# EasyEDA Pro project ProPrj_智能视觉集成板-V1.1.epro, schematic Schematic2

## Sheets
1 子驱 连接器: Board Name: 单驱加电源板; Create Date: 2025-01-11; Page Name: 子驱 连接器; Project Name: 009-智能视觉集成板-V1.1; Schematic Name: Schematic2; Update Date: 2025-01-12; Company: 嘉立创EDA; Page Size: A4; Version: V1.0
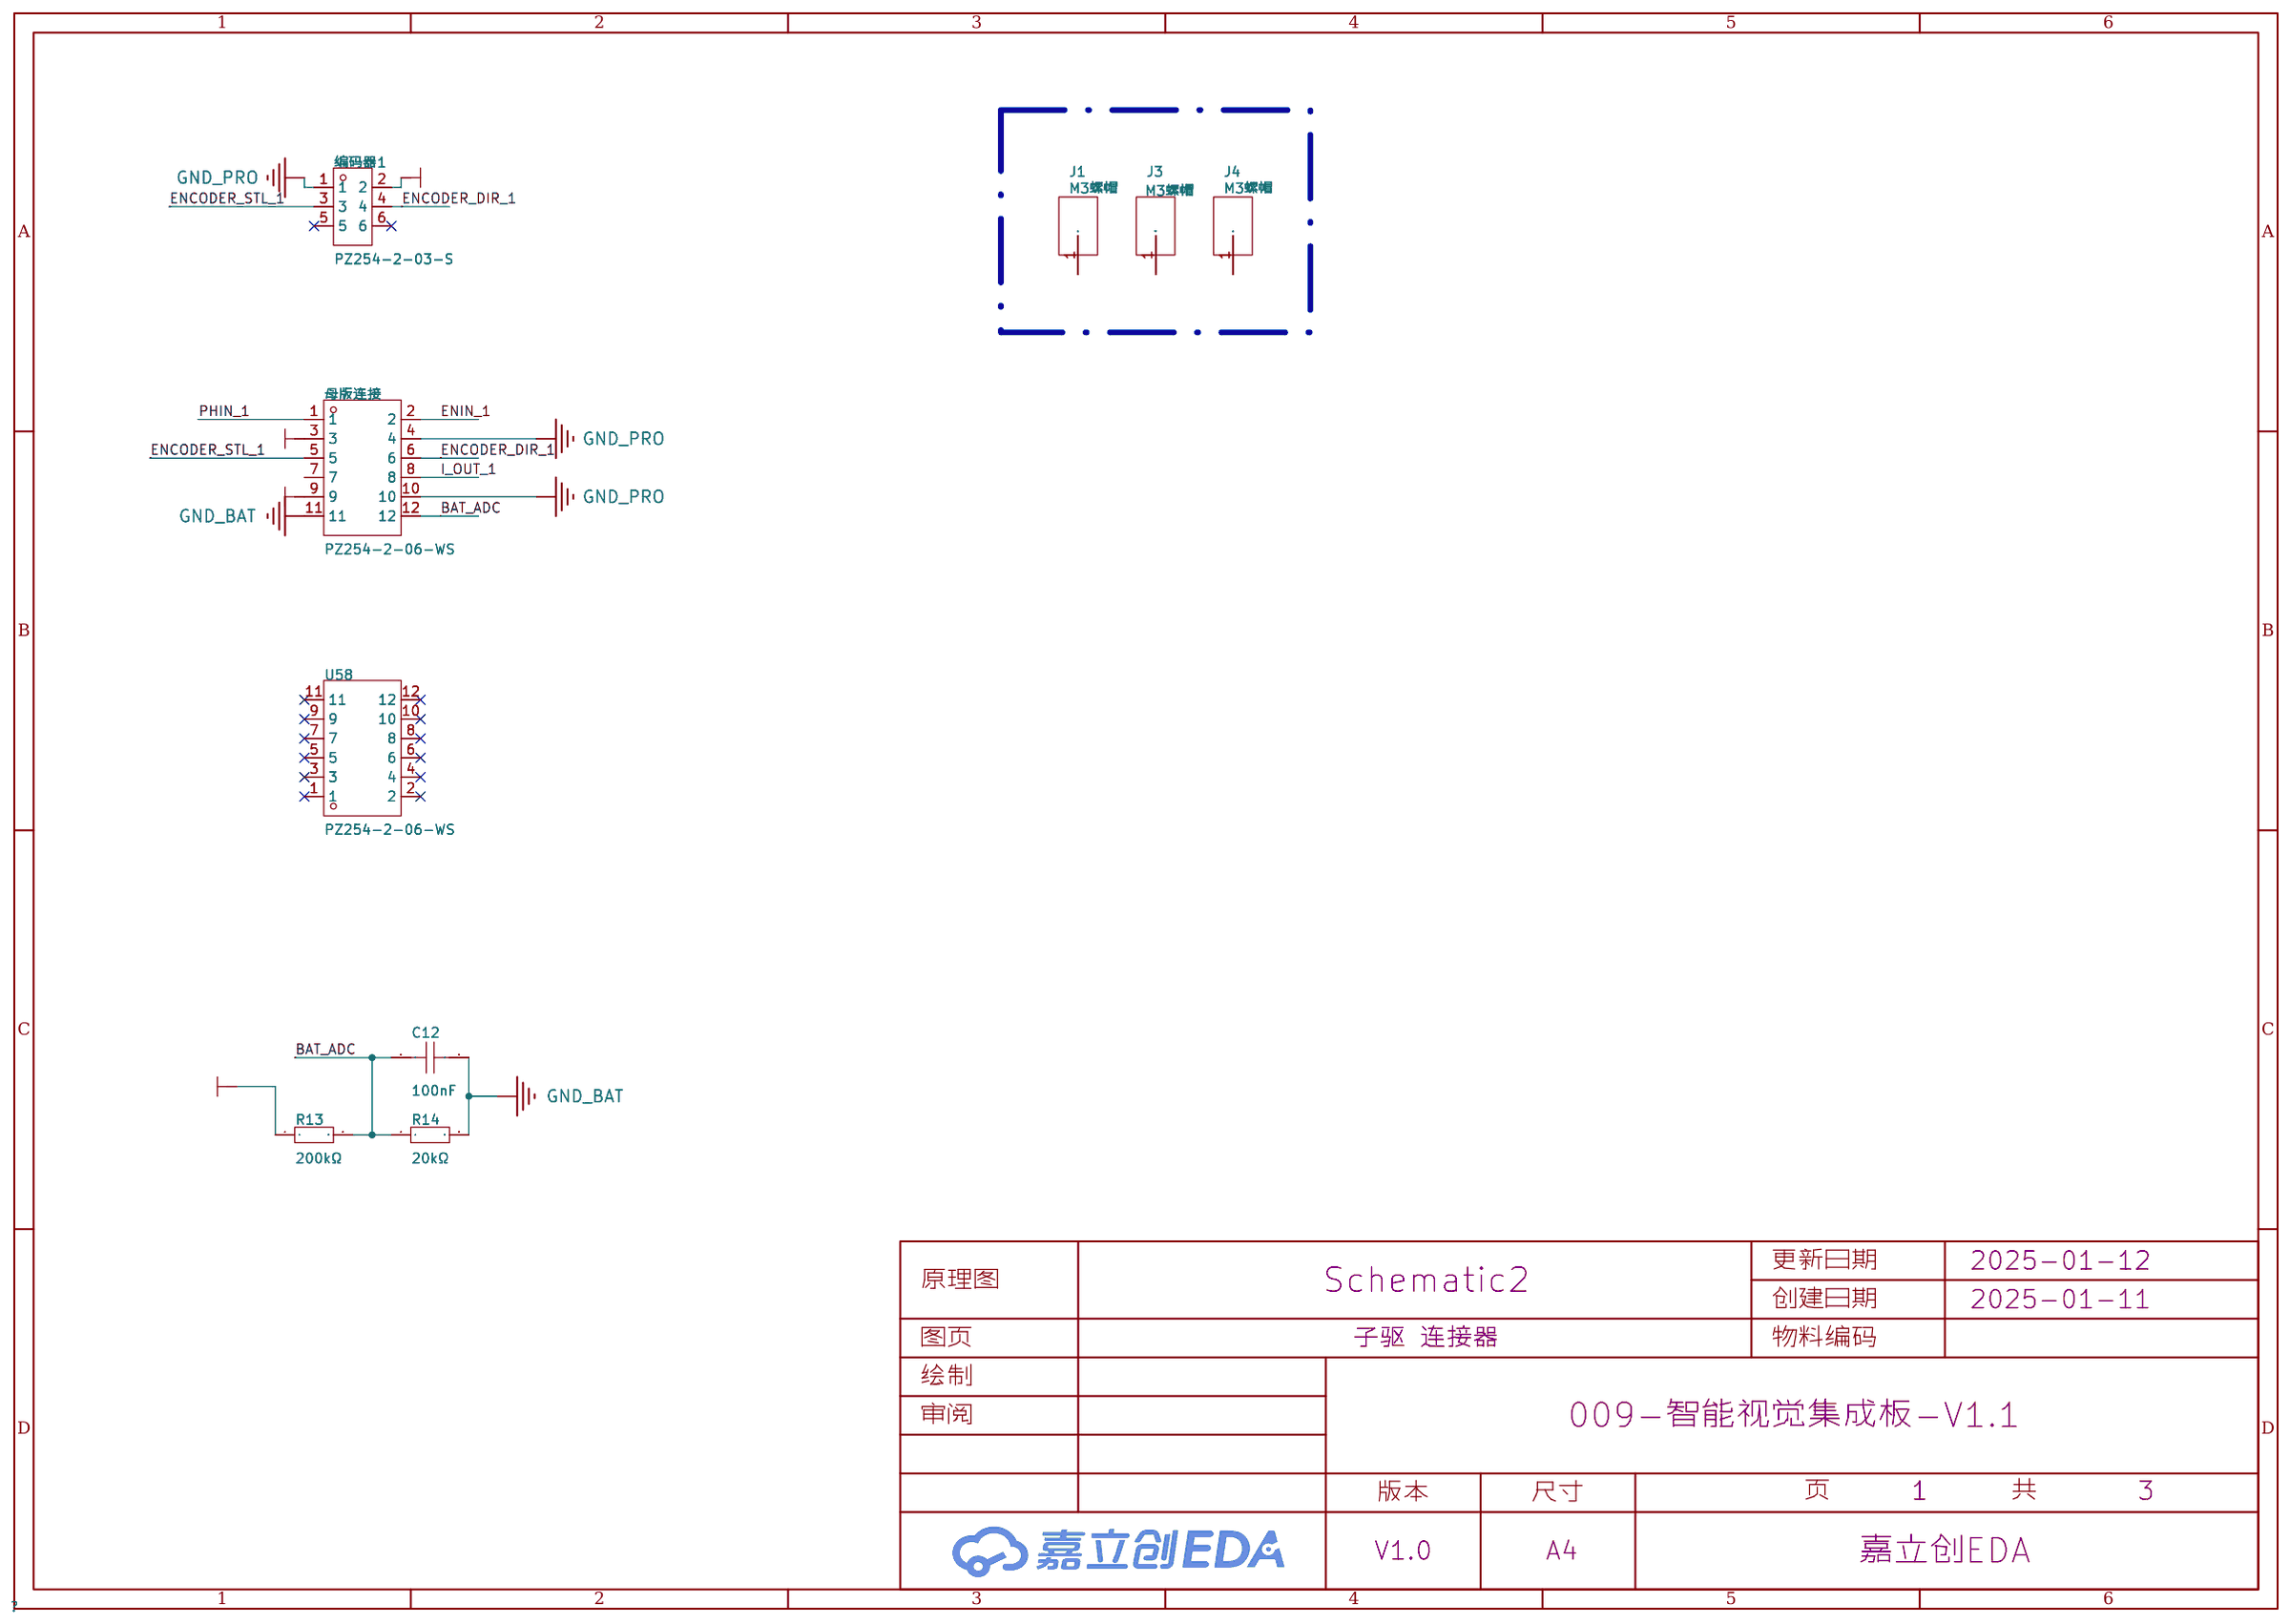
[diagram p3: 子驱 连接器]
2 子驱 单驱: Page Name: 子驱 单驱
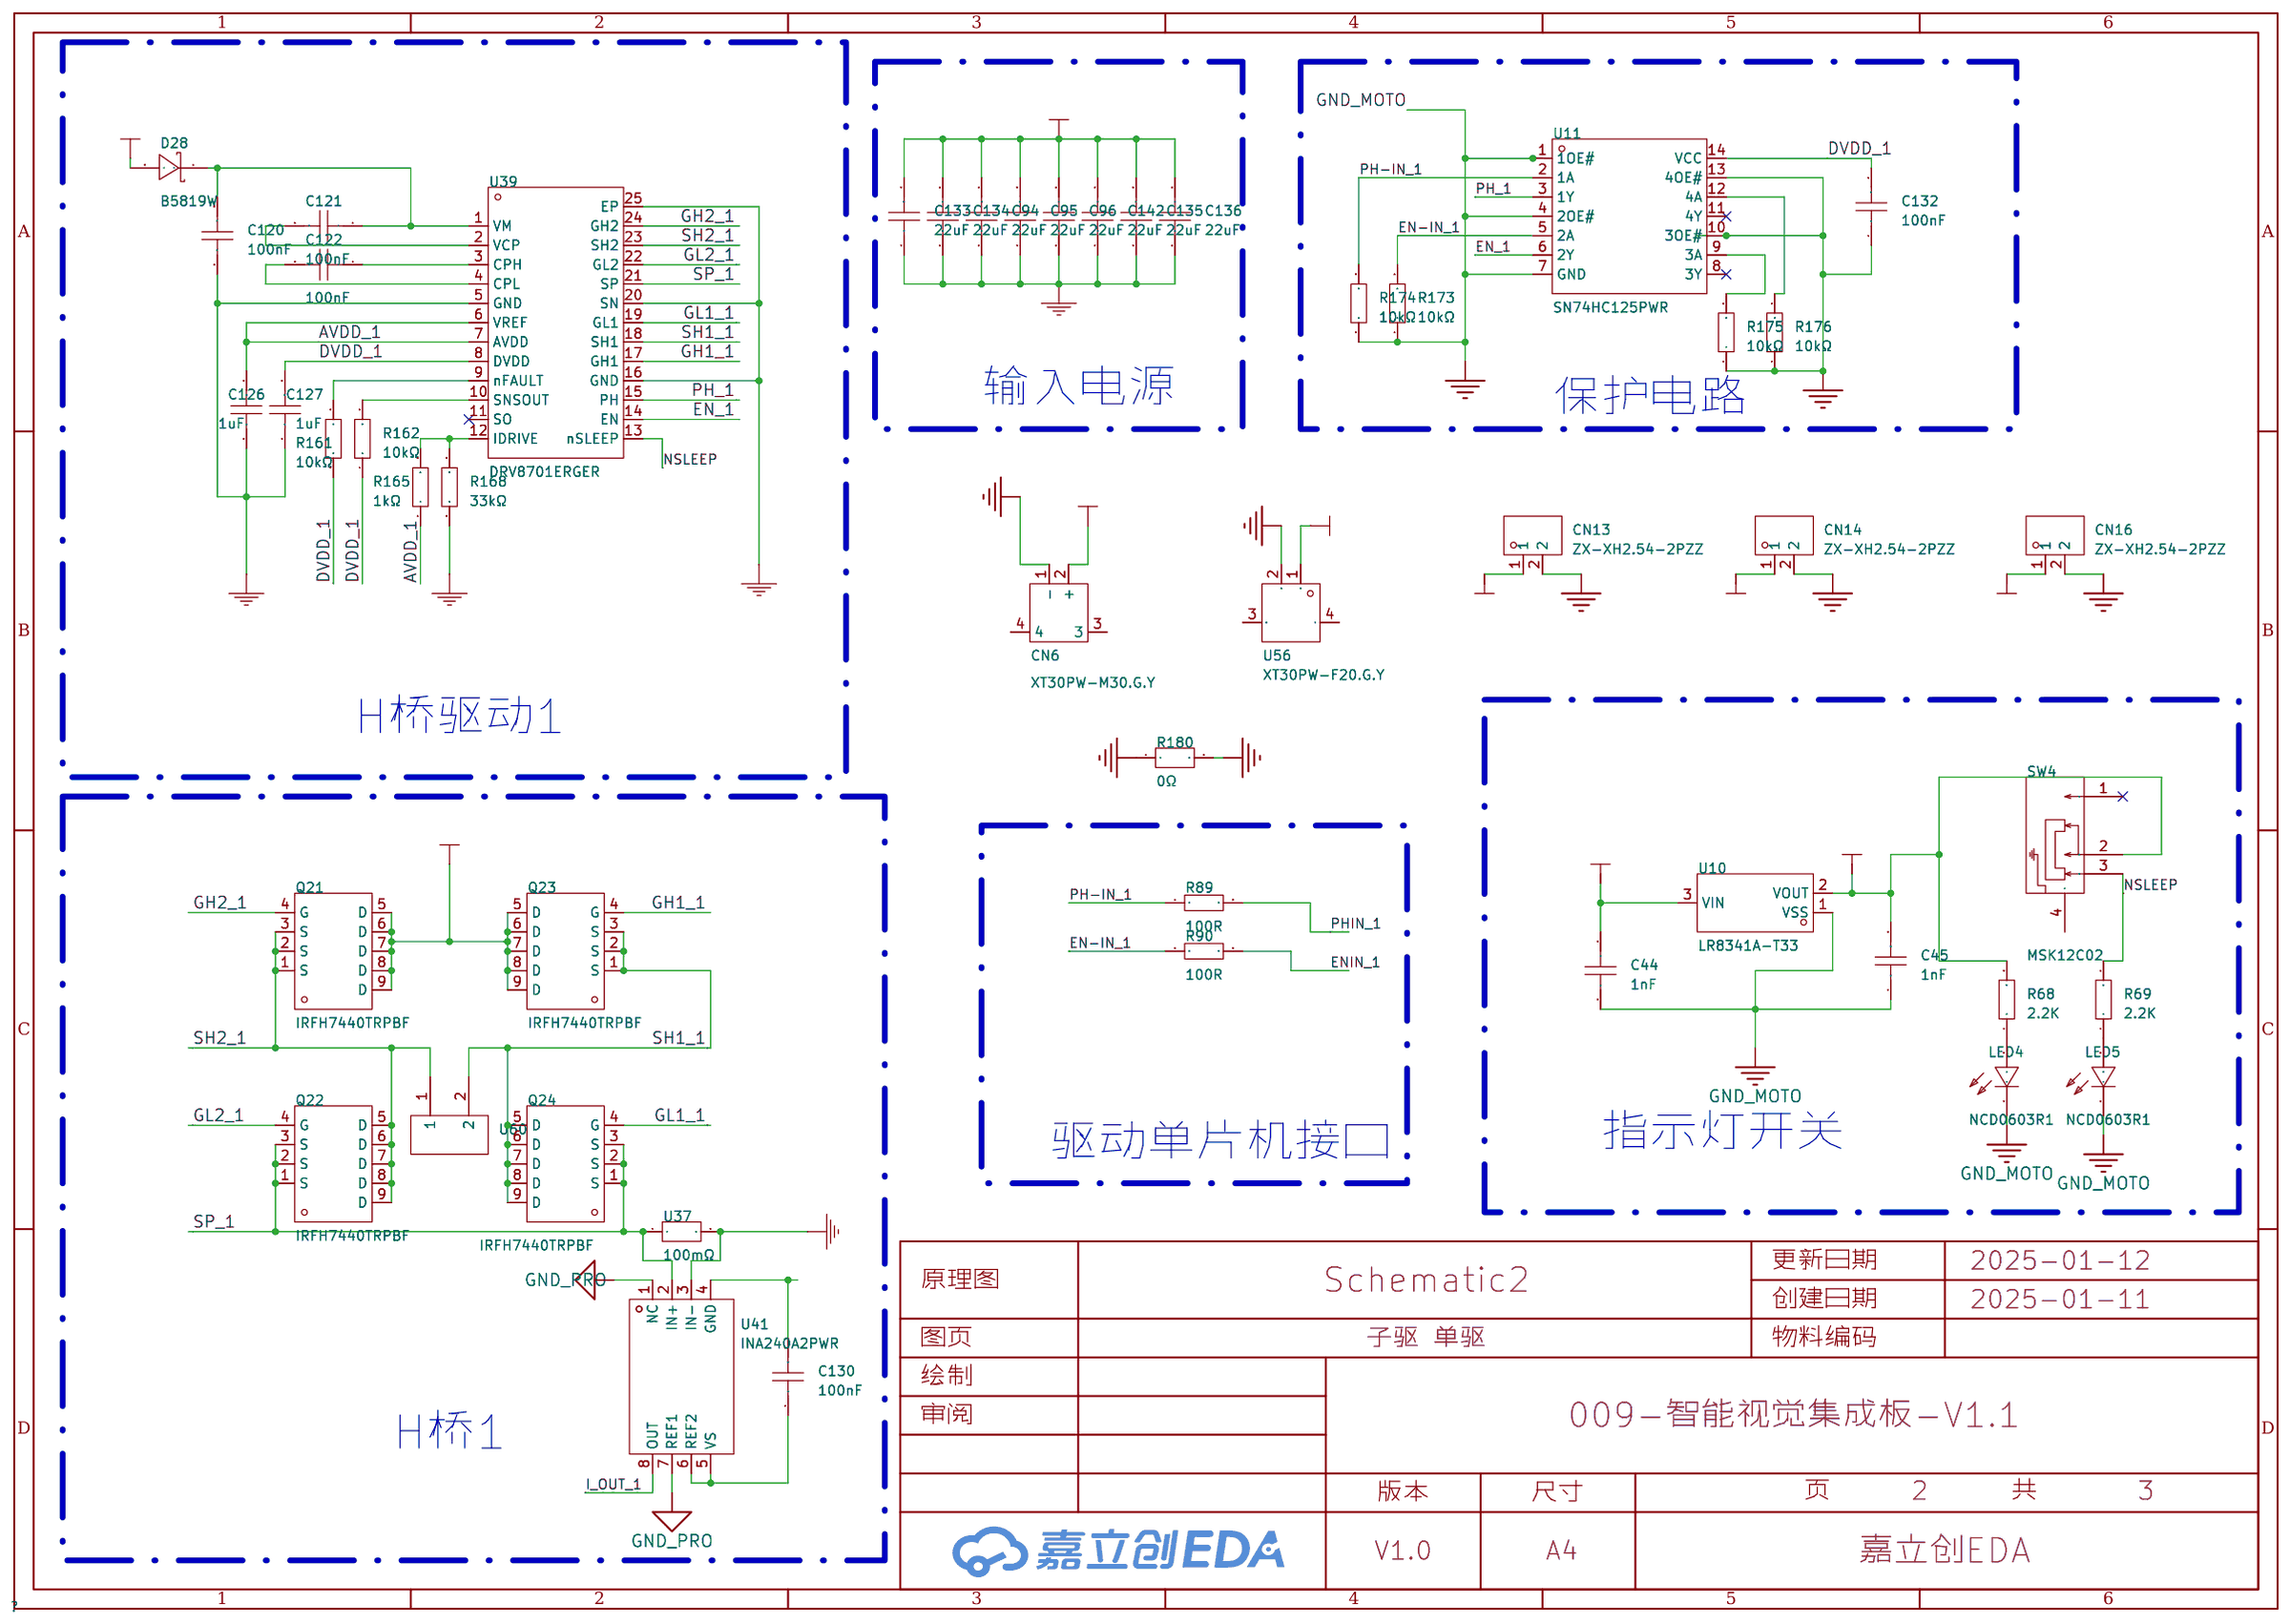
[diagram p4: 子驱 单驱]
3 子驱 舵机: Page Name: 子驱 舵机
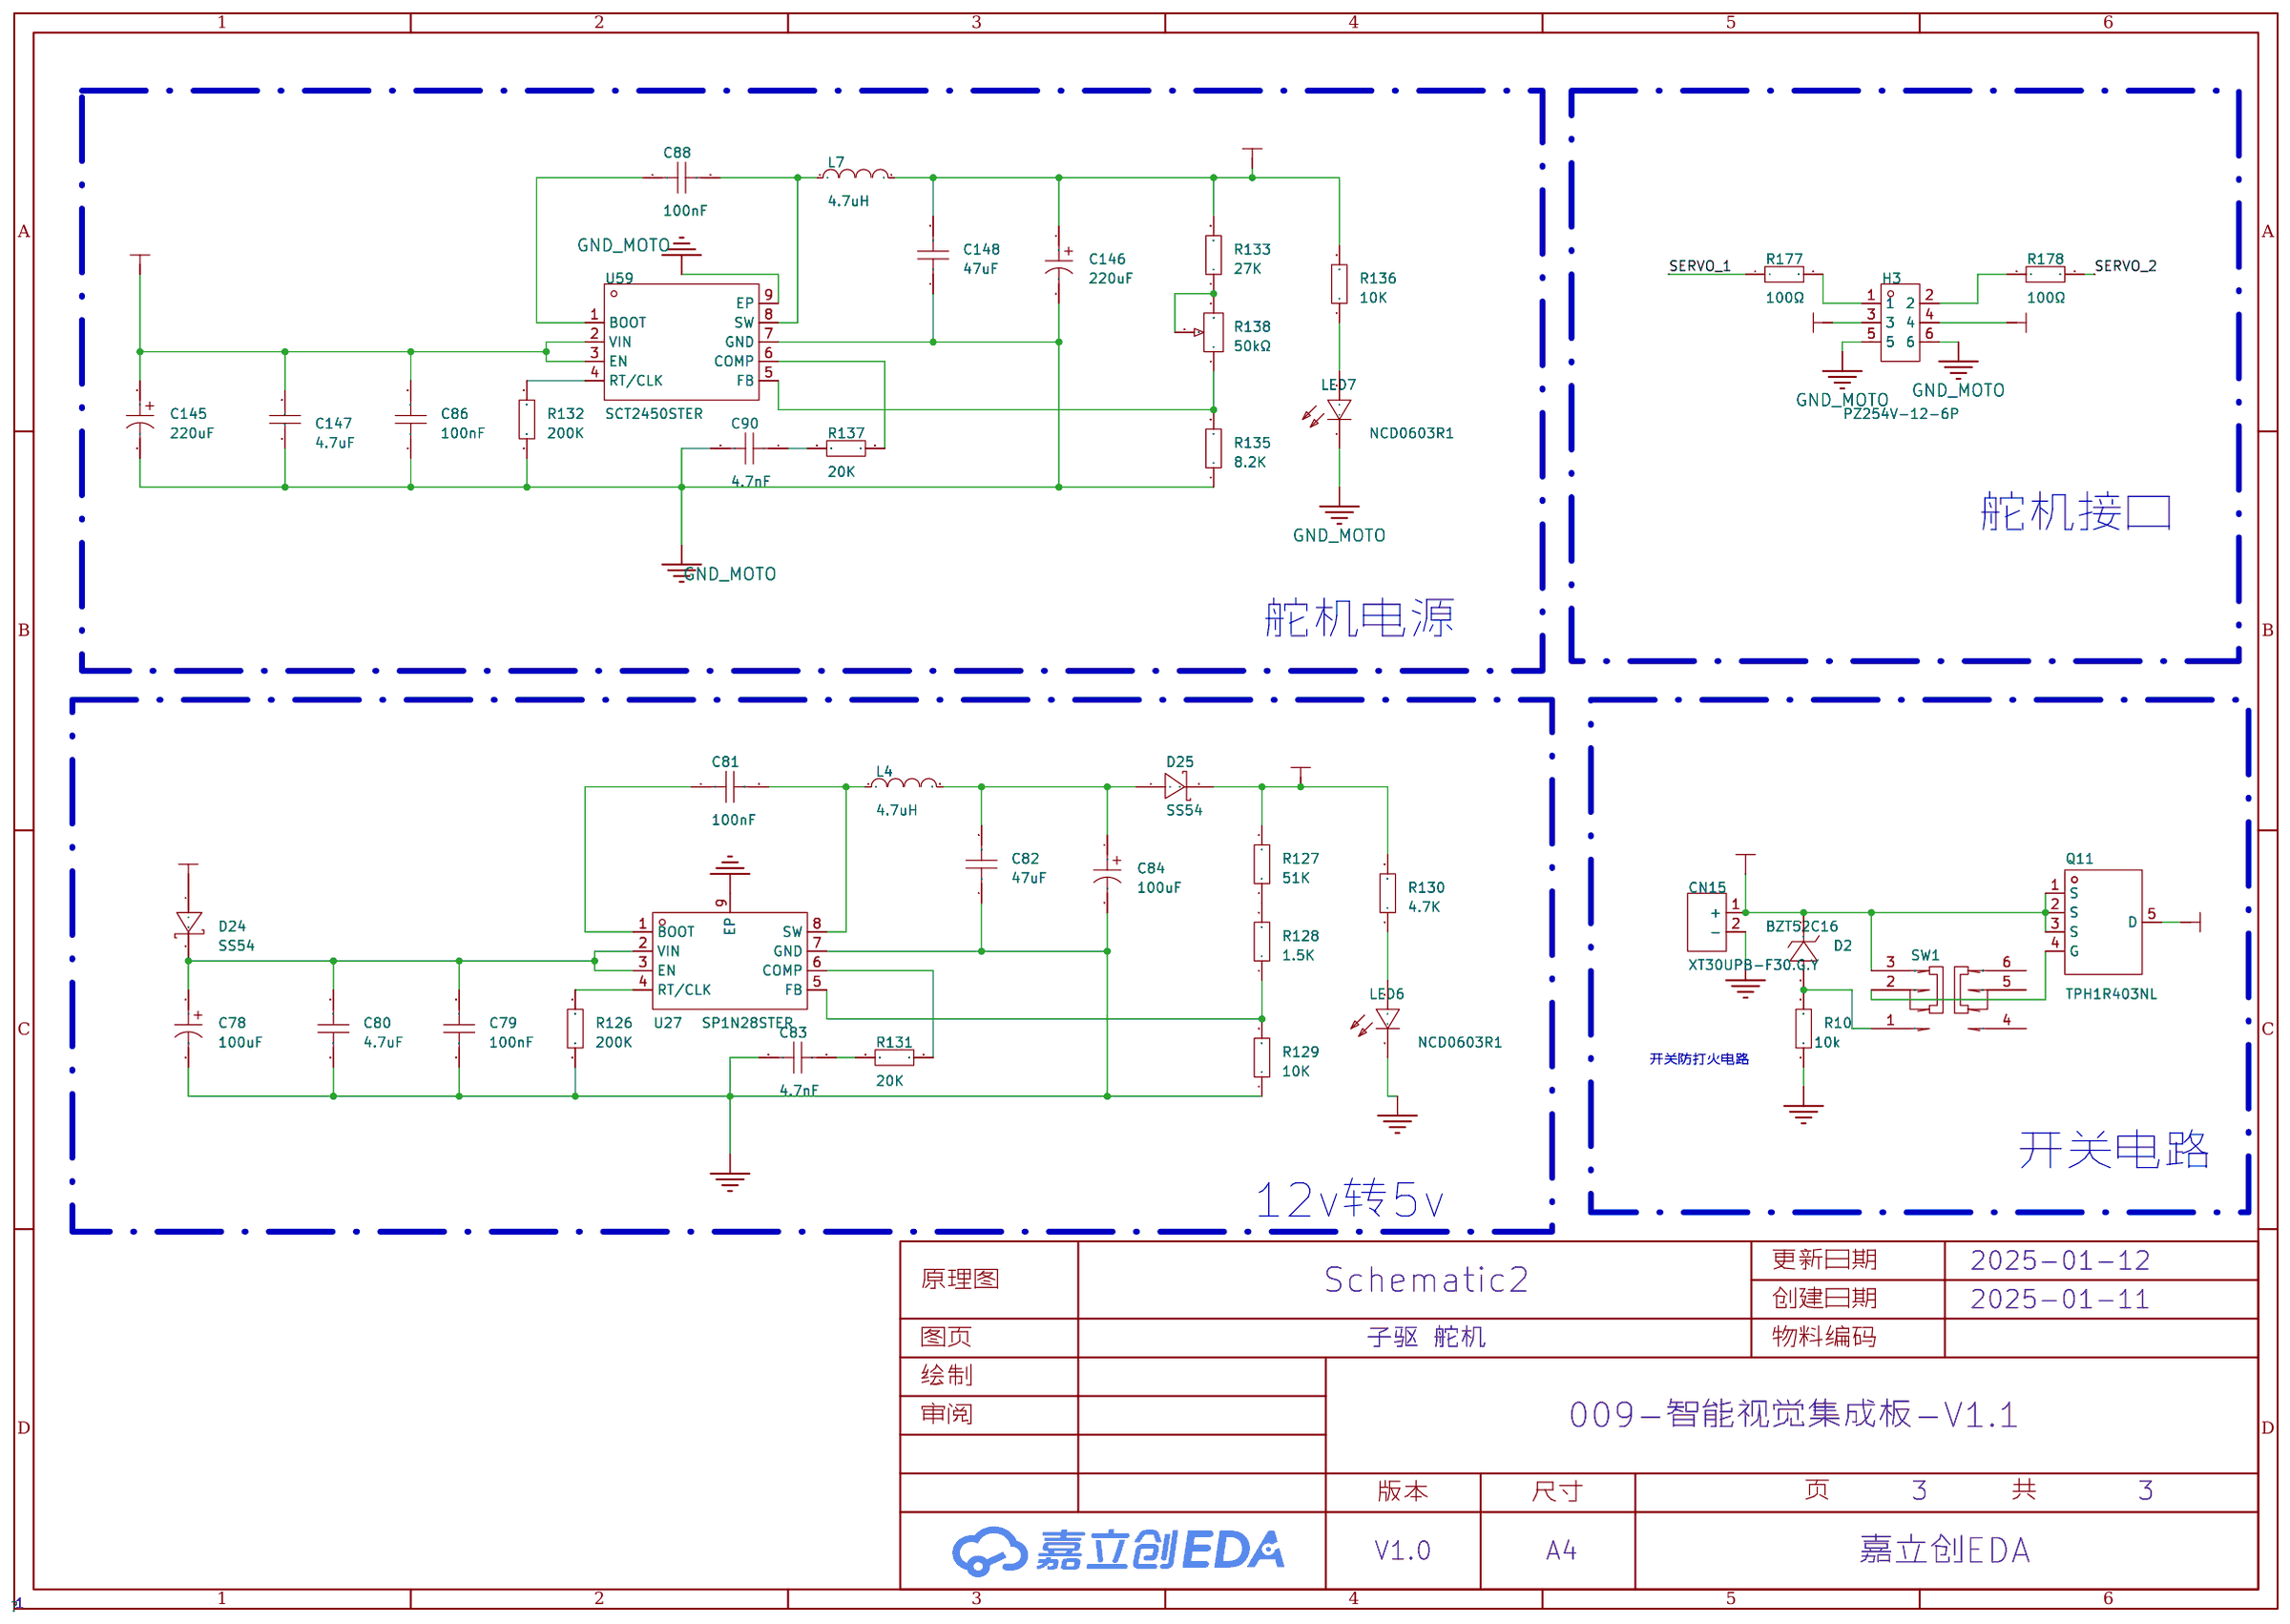
[diagram p5: 子驱 舵机]

## Parts
sheet 子驱 单驱
C44  1nF  [C0603]
C45  1nF  [C0603]
C94  22uF  [c1206]
C95  22uF  [c1206]
C96  22uF  [c1206]
C120  100nF  [C0402]
C121  100nF  [C0402]
C122  100nF  [C0402]
C126  1uF  [C0402]
C127  1uF  [C0402]
C130  100nF  [C0402]
C132  100nF  [C0603]
C133  22uF  [c1206]
C134  22uF  [c1206]
C135  22uF  [c1206]
C136  22uF  [c1206]
C142  22uF  [c1206]
CN6  XT30PW-M30.G.Y  [CONN-TH_XT30PW-M]
CN13  ZX-XH2.54-2PZZ  [CONN-TH_2P-P2.50_HX25003-2A]
CN14  ZX-XH2.54-2PZZ  [CONN-TH_2P-P2.50_HX25003-2A]
CN16  ZX-XH2.54-2PZZ  [CONN-TH_2P-P2.50_HX25003-2A]
D28  B5819W  [SOD-123_L2.8-W1.8-LS3.7-RD]
LED4  NCD0603R1  [LED0603-RD_RED]
LED5  NCD0603R1  [LED0603-RD_RED]
Q21  IRFH7440TRPBF  [DFN-8_L5.8-W4.9-P1.27-LS6.0-BL-1]
Q22  IRFH7440TRPBF  [DFN-8_L5.8-W4.9-P1.27-LS6.0-BL-1]
Q23  IRFH7440TRPBF  [DFN-8_L5.8-W4.9-P1.27-LS6.0-BL-1]
Q24  IRFH7440TRPBF  [DFN-8_L5.8-W4.9-P1.27-LS6.0-BL-1]
R68  2.2K  [R0603]
R69  2.2K  [R0603]
R89  100R  [R0603]
R90  100R  [R0603]
R161  10kΩ  [R0402]
R162  10kΩ  [R0402]
R165  1kΩ  [R0402]
R168  33kΩ  [R0402]
R173  10kΩ  [R0603]
R174  10kΩ  [R0603]
R175  10kΩ  [R0603]
R176  10kΩ  [R0603]
R180  0Ω  [R1206]
SW4  MSK12C02  [SW-TH_MSK12C02]
U10  LR8341A-T33  [SOT-23-3L_L2.9-W1.6-P1.90-LS2.8-BL]
U11  SN74HC125PWR  [TSSOP-14_L5.0-W4.4-P0.65-LS6.5-BL]
U37  100mΩ  [R1206]
U39  DRV8701ERGER  [VQFN-24_L4.0-W4.0-P0.50-BL-EP2.5]
U41  INA240A2PWR  [TSSOP-8_L4.4-W3.0-P0.65-LS6.4-BL]
U56  XT30PW-F20.G.Y  [CONN-TH_XT30PW-F-1]
U60  -  [2P焊接端子（大电流）]
sheet 子驱 舵机
C78  100uF  [CAP-SMD_BD6.3-L6.6-W6.6-LS7.4-FD]
C79  100nF  [C0603]
C80  4.7uF  [c1206]
C81  100nF  [C0603]
C82  47uF  [c1206]
C83  4.7nF  [C0603]
C84  100uF  [CAP-SMD_BD6.3-L6.6-W6.6-LS7.4-FD]
C86  100nF  [C0603]
C88  100nF  [C0603]
C90  4.7nF  [C0603]
C145  220uF  [CAP-SMD_BD6.3-L6.6-W6.6-LS7.8-FD]
C146  220uF  [CAP-SMD_BD6.3-L6.6-W6.6-LS7.8-FD]
C147  4.7uF  [c1206]
C148  47uF  [c1206]
CN15  XT30UPB-F30.G.Y  [CONN-TH_XT30UPB-F]
D2  BZT52C16  [SOD-123_L2.7-W1.7-LS3.8-RD]
D24  SS54  [SMA_L4.4-W2.8-LS5.4-R-RD]
D25  SS54  [SMA_L4.4-W2.8-LS5.4-R-RD]
H3  PZ254V-12-6P  [HDR-TH_6P-P2.54-V-M-R2-C3-S2.54]
L4  4.7uH  [IND-SMD_L7.0-W6.6]
L7  4.7uH  [IND-SMD_L7.0-W6.6]
LED6  NCD0603R1  [LED0603-RD_RED]
LED7  NCD0603R1  [LED0603-RD_RED]
Q11  TPH1R403NL  [POWERVDFN-8_L6.2-W5.2-P1.27-LS6.0-BL]
R10  10K  [R0603]
R126  200K  [R0603]
R127  51K  [R0603]
R128  1.5K  [R0603]
R129  10K  [R0603]
R130  4.7K  [R0603]
R131  20K  [R0603]
R132  200K  [R0603]
R133  27K  [R0603]
R135  8.2K  [R0603]
R136  10K  [R0603]
R137  20K  [R0603]
R138  50kΩ  [RES-ADJ-TH_3P-L5.0-W4.5-P2.35-BR]
R177  100Ω  [R0603]
R178  100Ω  [R0603]
SW1  SS-3235S-L3  [SW-SMD_SS-3235S-L3.00]
U27  SP1N28STER  [ESOP-8_L4.9-W3.9-P1.27-LS6.0-BL-EP3.1]
U59  SCT2450STER  [ESOP-8_L4.9-W3.9-P1.27-LS6.0-BL-EP]
sheet 子驱 连接器
C12  100nF  [C0603]
J1  M3螺帽  [M3螺帽]
J3  M3螺帽  [M3螺帽]
J4  M3螺帽  [M3螺帽]
R13  200kΩ  [R0603]
R14  20kΩ  [R0603]
U58  PZ254-2-06-WS  [HDR-SMD_12P-P2.54_HCTL_PZ254-2-06-WS]
母版连接  PZ254-2-06-WS  [HDR-SMD_12P-P2.54_HCTL_PZ254-2-06-WS]
编码器1  PZ254-2-03-S  [HDR-SMD_6P-P2.54-V-M-R2-C3-LS7.5-2]

## Library data of the parts
C44 C45 C79-C83 C86 C88 C90 = CAP_0603: Supplier Footprint: 0603
C94-C96 C133-C136 C142 = CGA1206X5R226M350NT: 容值:22uF;精度:±20%;额定电压:35V;材质(温度系数):X5R;; LCSC Part Name: 22uF ±20% 35V; Supplier Part: C6119969; Manufacturer: HRE(芯声); Supplier Footprint: 1206; JLCPCB Part Class: 扩展库; Supplier: LCSC; Tolerance: ±20%; Voltage Rated: 35V; Temperature Coefficient: X5R
C120-C122 C130 = CL05B104KB54PNC: 容值:100nF;精度:±10%;额定电压:50V;材质(温度系数):X7R;; LCSC Part Name: 100nF ±10% 50V; Supplier Part: C307331; Manufacturer: SAMSUNG(三星); Supplier Footprint: 0402; JLCPCB Part Class: 基础库; Datasheet: https://atta.szlcsc.com/upload/public/pdf/source/20160218/1457707763339.pdf; Supplier: LCSC; Tolerance: ±10%; Voltage Rated: 50V; Temperature Coefficient: X7R
C126 C127 = GRM155R61H105KE05D: 容值:1uF;精度:±10%;额定电压:50V;材质(温度系数):X5R;; LCSC Part Name: 1uF ±10% 50V; Supplier Part: C1518208; Manufacturer: muRata(村田); Supplier Footprint: 0402; JLCPCB Part Class: 扩展库; Datasheet: https://atta.szlcsc.com/upload/public/pdf/source/20210607/3F03D47137F6EC7729AB4067EB2A6EB3.pdf; Supplier: LCSC; Tolerance: ±10%; Voltage Rated: 50V; Temperature Coefficient: X5R
C12 C132 = CGA0603X7R104K500JT: 容值:100nF;精度:±10%;额定电压:50V;材质(温度系数):X7R;; LCSC Part Name: 100nF ±10% 50V; Supplier Part: C6119867; Manufacturer: HRE(芯声); Supplier Footprint: 0603; JLCPCB Part Class: 扩展库; Supplier: LCSC; Tolerance: ±10%; Voltage Rated: 50V; Temperature Coefficient: X7R
CN6 = XT30PW-M30.G.Y: 类别:-;类型1:-;; LCSC Part Name: AMASS(艾迈斯)航模插头 卧式弯脚 XT30PW-M公头; Supplier Part: C431092; Manufacturer: AMASS(艾迈斯); JLCPCB Part Class: 扩展库; Datasheet: https://atta.szlcsc.com/upload/public/pdf/source/20220222/6A9F22F7850E25B33E1BE430ADF8560B.pdf; Supplier: LCSC; Type: 航模插头; RatedVoltage: DC 500V; InterfaceType: 公头; RatedCurrent: 15A; RecommendedWireGauge: 16/18/20AWG; contact resistance: 1.2mΩ; specifications: 2pin
CN13 CN14 CN16 = ZX-XH2.54-2PZZ: 插针结构:1x2P;间距:-;安装方式:直插;参考系列:XH;总PIN数:2P;排数:1;每排PIN数:2;行距:-;额定电流:3A;触头材质:黄铜;触头镀层:锡;工作温度范围:-25℃~+85℃;; LCSC Part Name: 1x2P 直插 系列:XH 黄色耐高温型号：ZX-XH2.54-2PZZ-Y 红色耐高温型号：ZX-XH2.54-2PZZ-R 配套胶壳型号：ZX-XH2.54-2PJK 配套端子型号：ZX-XH2.54-DZ 配套杜邦线型号：ZX-XH2.54-2PBXC; Supplier Part: C7429632; Manufacturer: Megastar(兆星); JLCPCB Part Class: 扩展库; Datasheet: https://atta.szlcsc.com/upload/public/pdf/source/20230619/19BA6947230AA44A04D3EDD65E618FD0.pdf; Supplier: LCSC; Pins Structure: 1x2P; Mounting Style: 直插; Reference Series: XH; Number of Pins: 2P; Number of Rows: 1; Number of PINs Per Row: 2; Current Rating (Max): 3A; Contact Material: 黄铜; Contact Plating: 锡; Operating Temperature Range: -25℃~+85℃
D28 = B5819W_C64885: 二极管配置:独立式;正向压降(Vf):900mV@3A;直流反向耐压(Vr):40V;整流电流:1A;; LCSC Part Name: 电压:40V 电流:1A; Supplier Part: C64885; Manufacturer: MDD(辰达半导体); Supplier Footprint: SOD-123; JLCPCB Part Class: 扩展库; Datasheet: https://atta.szlcsc.com/upload/public/pdf/source/20230823/08094EB15E96CCD3558B35DDD25E45C2.pdf; Supplier: LCSC; Diode Configuration: 独立式; Forward Voltage (Vf@If): 900mV@3A; Reverse Voltage (Vr): 40V; Rectified Current: 1A; Reverse Leakage Current (Ir): 1mA@40V
LED4-LED7 = NCD0603R1_C84263: 灯头类型:-;发光颜色:红色;正向电压(VF):1.6V~2.6V;功率:65mW;正向电流:20mA;主波长:615nm~630nm;二极管配置:独立二极管;透镜颜色:无色透明透镜;色温:-;发光强度:80mcd~220mcd;发光角度:130°;载带方式:-;工作温度:-30℃~+85℃;; Supplier Part: C84263; Manufacturer: 国星光电; Supplier Footprint: 0603; JLCPCB Part Class: 扩展库; Datasheet: https://atta.szlcsc.com/upload/public/pdf/source/20200820/C84263_DABC6A75E58F576973B407FDBA283D60.pdf; Supplier: LCSC; Emitted Color: 红色; Forward Voltage (VF): 1.6V~2.6V; Power Dissipation: 65mW; Forward Current: 20mA; Dominant Wavelength: 615nm~630nm; Diode Configuration: 独立二极管; Lens Color: 无色透明透镜; Luminous Intensity: 80mcd~220mcd; Viewing Angle: 130°; Operating Temperature: -30℃~+85℃
Q21-Q24 = IRFH7440TRPBF: 类型:N沟道;漏源电压(Vdss):40V;连续漏极电流(Id):85A;功率(Pd):104W;导通电阻(RDS(on)@Vgs,Id):2.4mΩ@10V,50A;阈值电压(Vgs(th)@Id):3.9V@100uA;; LCSC Part Name: N沟道 耐压:40V 电流:85A; Supplier Part: C67862; Manufacturer: Infineon(英飞凌); Supplier Footprint: PQFN(5x6); JLCPCB Part Class: 扩展库; Datasheet: https://atta.szlcsc.com/upload/public/pdf/source/20190419/C386359_273C98C00830BF5419F9D4766EDDF693.pdf; Supplier: LCSC; Type: N沟道; Drain Source Voltage (Vdss): 40V; Continuous Drain Current (Id): 85A; Power Dissipation (Pd): 104W; Drain Source On Resistance (RDS(on)@Vgs,Id): 2.4mΩ@10V,50A; Gate Threshold Voltage (Vgs(th)@Id): 3.9V@100uA; Total Gate Charge (Qg@Vgs): 138nC@10V; Input Capacitance (Ciss@Vds): 4.574nF@25V; Operating Temperature: -55℃~+150℃@(Tj)
R10 R68 R69 R89 R90 R126-R133 R135-R137 = Res_0603: Supplier Footprint: 0603
R161 R162 = 0402WGF1002TCE: 电阻类型:厚膜电阻;阻值:10kΩ;精度:±1%;功率:62.5mW;最大工作电压:50V;温度系数:±100ppm/℃;; LCSC Part Name: 10kΩ ±1% 62.5mW 厚膜电阻; Supplier Part: C25744; Manufacturer: UNI-ROYAL(厚声); Supplier Footprint: 0402; JLCPCB Part Class: 基础库; Datasheet: https://atta.szlcsc.com/upload/public/pdf/source/20200306/C422600_1E6D84923E4A46A82E41ADD87F860B5C.pdf; Supplier: LCSC; Type: 厚膜电阻; Tolerance: ±1%; Power(Watts): 62.5mW; Overload Voltage (Max): 50V; Temperature Coefficient: ±100ppm/℃; Operating Temperature Range: -55℃~+155℃
R165 = 0402WGF1001TCE: 电阻类型:厚膜电阻;阻值:1kΩ;精度:±1%;功率:62.5mW;最大工作电压:50V;温度系数:±100ppm/℃;; LCSC Part Name: 1kΩ ±1% 62.5mW 厚膜电阻; Supplier Part: C11702; Manufacturer: UNI-ROYAL(厚声); Supplier Footprint: 0402; JLCPCB Part Class: 基础库; Datasheet: https://atta.szlcsc.com/upload/public/pdf/source/20200306/C422600_1E6D84923E4A46A82E41ADD87F860B5C.pdf; Supplier: LCSC; Type: 厚膜电阻; Tolerance: ±1%; Power(Watts): 62.5mW; Overload Voltage (Max): 50V; Temperature Coefficient: ±100ppm/℃; Operating Temperature Range: -55℃~+155℃
R168 = 0402WGF3302TCE: 电阻类型:厚膜电阻;阻值:33kΩ;精度:±1%;功率:62.5mW;最大工作电压:50V;温度系数:±100ppm/℃;; LCSC Part Name: 33kΩ ±1% 62.5mW 厚膜电阻; Supplier Part: C25779; Manufacturer: UNI-ROYAL(厚声); Supplier Footprint: 0402; JLCPCB Part Class: 基础库; Datasheet: https://atta.szlcsc.com/upload/public/pdf/source/20200306/C422600_1E6D84923E4A46A82E41ADD87F860B5C.pdf; Supplier: LCSC; Type: 厚膜电阻; Tolerance: ±1%; Power(Watts): 62.5mW; Overload Voltage (Max): 50V; Temperature Coefficient: ±100ppm/℃; Operating Temperature Range: -55℃~+155℃
R173-R176 = 0603WAF1002T5E: 电阻类型:厚膜电阻;阻值:10kΩ;精度:±1%;功率:100mW;最大工作电压:75V;温度系数:±100ppm/℃;; LCSC Part Name: 厚膜电阻 10kΩ ±1% 100mW; Supplier Part: C25804; Manufacturer: UNI-ROYAL(厚声); Supplier Footprint: 0603; JLCPCB Part Class: 基础库; Datasheet: https://atta.szlcsc.com/upload/public/pdf/source/20200306/C422600_1E6D84923E4A46A82E41ADD87F860B5C.pdf; Supplier: LCSC; Type: 厚膜电阻; Tolerance: ±1%; Power(Watts): 100mW; Overload Voltage (Max): 75V; Temperature Coefficient: ±100ppm/℃; Operating Temperature Range: -55℃~+155℃
R180 = FRC1206P000 TS: 电阻类型:厚膜电阻;阻值:0Ω;精度:±5%;功率:250mW;最大工作电压:200V;; LCSC Part Name: 0Ω ±5% 250mW 厚膜电阻; Supplier Part: C2907406; Manufacturer: FOJAN(富捷); Supplier Footprint: 1206; JLCPCB Part Class: 扩展库; Datasheet: https://atta.szlcsc.com/upload/public/pdf/source/20211221/925EC7D7225764EE0046F22065062C87.pdf; Supplier: LCSC; Type: 厚膜电阻; Tolerance: ±5%; Power(Watts): 250mW; Overload Voltage (Max): 200V; Operating Temperature Range: -55℃~+155℃
SW4 = MSK12C02: 电路结构:单刀双掷;安装方式:卧贴;开关颜色:-;额定电流(DC):50mA;额定电压(DC):12V;额定电流(AC):-;额定电压(AC):-;机械寿命:1万次;; LCSC Part Name: 两档侧拨贴片 7脚 滑动开关; Supplier Part: C431540; Manufacturer: SHOU HAN(首韩); Supplier Footprint: SMD; JLCPCB Part Class: 扩展库; Datasheet: https://atta.szlcsc.com/upload/public/pdf/source/20190925/C431540_89155AEF0758B9AD1B2D805F83FB12E3.pdf; Supplier: LCSC; Circuit: 单刀双掷; Pin Style: SMD接片; Switch Length: 8mm; Switch Width: 2.8mm; Switch Height: 1.4mm; Mounting Style: 卧贴; Current Rating (DC): 50mA; Voltage Rating (DC): 12V; Mechanical Life: 1万次; Operating Temperature: -20℃~+70℃
U10 = LR8341A-T33: 输出类型:固定;最大输入电压:40V;输出电压:3.3V;最大输出电流:100mA;电源纹波抑制比(PSRR):55dB@(1kHz);输出极性:正极;; LCSC Part Name: 输入40V 输出3.3V 100mA; Supplier Part: C2829465; Manufacturer: LR(朗瑞); Supplier Footprint: SOT-23-3L; JLCPCB Part Class: 扩展库; Datasheet: https://atta.szlcsc.com/upload/public/pdf/source/20210426/C2829465_61F15D7ACE9671B48D4F69A8092B0D8F.pdf; Supplier: LCSC; Output Type: 固定; Maximum Input Voltage: 40V; Output Voltage: 3.3V; MAX Output Current: 100mA; Power Supply Rejection Ratio (PSRR): 55dB@(1kHz); standby current: 2uA; Operating Temperature: -40℃~+85℃; Output Polarity: 正极; Number of Outputs: 1
U11 = SN74HC125PWR: 输入类型:-;电源电压:2V~6V;元件数:4;每个元件位数:1;灌电流(IOL):7.8mA;拉电流(IOH):7.8mA;; Supplier Part: C132994; Manufacturer: TI(德州仪器); Supplier Footprint: TSSOP-14; JLCPCB Part Class: Extended Part; Datasheet: https://www.ti.com/cn/lit/gpn/sn74hc125; Supplier: LCSC; output type: 三态; Supply Voltage: 2V~6V; Number of Elements: 4; Number of Bits per Element: 1; Sink Current: 7.8mA; Source Current: 7.8mA; Logic Family: 74HC; Operating Temperature: -40℃~+85℃
U37 = FRM121WFR010TM: 电阻类型:采样电阻;阻值:10mΩ;精度:±1%;额定压降:-;功率:1W;温度系数:±50ppm/℃;安装方式:-;; LCSC Part Name: 10mΩ ±1% 1W; Supplier Part: C7467248; Manufacturer: FOJAN(富捷); Supplier Footprint: 1206; JLCPCB Part Class: 扩展库; Datasheet: https://atta.szlcsc.com/upload/public/pdf/source/20240709/7FCE84187288C94C67B1004F90EDDF14.pdf; Supplier: LCSC; Type: 采样电阻; Tolerance: ±1%; Power(Watts): 1W; Temperature Coefficient: ±50ppm/℃
U39 = DRV8701ERGER: DRV8701 47V H 桥智能栅极驱动器; LCSC Part Name: 有刷直流电机驱动芯片 45V; Supplier Part: C90964; Manufacturer: TI(德州仪器); Supplier Footprint: VQFN-24-EP(4x4); JLCPCB Part Class: 扩展库; Datasheet: https://www.ti.com/cn/lit/gpn/drv8701; Supplier: LCSC
U41 = INA240A2PWR: 放大器数:单路;; Supplier Part: C129949; Manufacturer: TI(德州仪器); Supplier Footprint: TSSOP-8; JLCPCB Part Class: 扩展库; Datasheet: https://www.ti.com/cn/lit/gpn/ina240; Supplier: LCSC; Number of Channels: 单路; Supply Current: 1.8mA; Operating Temperature: -40℃~+125℃
U56 = XT30PW-F20.G.Y: 类别:-;类型1:-;; LCSC Part Name: AMASS(艾迈斯)电源连接器 母头 XT30PW-F; Supplier Part: C2913282; Manufacturer: AMASS(艾迈斯); JLCPCB Part Class: 扩展库; Datasheet: https://atta.szlcsc.com/upload/public/pdf/source/20231218/06CFCF98887A9A87638B0856A725C8FD.pdf; Supplier: LCSC; Type: 航模插头; InterfaceType: 母头
U60 = 大电流焊接端子
C78 C84 = RVT100UF35V67RV0034: 容值:100uF;精度:±20%;额定电压:35V;纹波电流:87mA@120kHz;等效串联电阻:-;; LCSC Part Name: 100uF ±20% 35V; Supplier Part: C2836442; Manufacturer: KNSCHA(科尼盛); Supplier Footprint: SMD,D6.3xL7.7mm; JLCPCB Part Class: 扩展库; Datasheet: https://atta.szlcsc.com/upload/public/pdf/source/20210528/C2836442_7F6389BF36F63F32D6DF3A507E8E95D6.pdf; Supplier: LCSC; Tolerance: ±20%; Rated Voltage: 35V; Ripple Current: 87mA@120kHz; φD: 6.3mm; L: 7.7mm; Lifetime @ Temp: 2000hrs@105℃; Operating Temperature: -55℃~+105℃
C145 C146 = GVT1E227M0608CNVC: 容值:220uF;精度:±20%;额定电压:25V;纹波电流:120mA@120Hz;; LCSC Part Name: 220uF ±20% 25V; Supplier Part: C2983317; Manufacturer: HRK(鸿瑞凯电子); Supplier Footprint: SMD,D6.3xL7.7mm; JLCPCB Part Class: 扩展库; Datasheet: https://atta.szlcsc.com/upload/public/pdf/source/20220321/A04A91A46495B899B204BF58325E1842.pdf; Supplier: LCSC; Tolerance: ±20%; Rated Voltage: 25V; Ripple Current: 120mA@120Hz; φD: 6.3mm; L: 8mm; Lifetime @ Temp: 2000hrs@105℃; Operating Temperature: -55℃~+105℃
C147 = CL31B475KBHNNNE: 容值:4.7uF;精度:±10%;额定电压:50V;材质(温度系数):X7R;; LCSC Part Name: 4.7uF ±10% 50V; Supplier Part: C51205; Manufacturer: SAMSUNG(三星); Supplier Footprint: 1206; JLCPCB Part Class: 扩展库; Datasheet: https://atta.szlcsc.com/upload/public/pdf/source/20160218/1457707763339.pdf; Supplier: LCSC; Tolerance: ±10%; Voltage Rated: 50V; Temperature Coefficient: X7R
C148 = HGC1206R5476M250NSPJ: 容值:47uF;精度:±20%;额定电压:25V;材质(温度系数):X5R;; LCSC Part Name: 47uF ±20% 25V; Supplier Part: C22367835; Manufacturer: Chinocera(华瓷); Supplier Footprint: 1206; JLCPCB Part Class: 扩展库; Datasheet: https://atta.szlcsc.com/upload/public/pdf/source/20240326/E6CB0DC43BB858B74F4352229FABFDCA.pdf; Supplier: LCSC; Tolerance: ±20%; Voltage Rated: 25V; Temperature Coefficient: X5R
CN15 = XT30UPB-F30.G.Y: 类别:-;类型1:-;; LCSC Part Name: AMASS(艾迈斯)直立焊板式连接器XT30UPB30-F.G.*; Supplier Part: C108769; Manufacturer: AMASS(艾迈斯); JLCPCB Part Class: 扩展库; Datasheet: https://atta.szlcsc.com/upload/public/pdf/source/20220715/AFD68B9E8B6CA95A7295DBF4AF9325E4.pdf; Supplier: LCSC; Brand: 艾迈斯; Type: 航模插头; Colour: 黄色; RatedVoltage: DC 500V; InterfaceType: 母头; MetalMaterial: 镀金; InsulationMaterial: PA; RatedCurrent: 15A; contact resistance: 0.65mΩ
D2 = BZT52C16_C727007: 二极管配置:独立式;稳压值(标称值):16V;稳压值(范围):15.3V~17.1V;功率:500mW;精度:-;; Supplier Part: C727007; Manufacturer: TWGMC(台湾迪嘉); Supplier Footprint: SOD-123; JLCPCB Part Class: 扩展库; Datasheet: https://atta.szlcsc.com/upload/public/pdf/source/20200828/C727006_A23CB424A23C0F54CFF10A724B844049.pdf; Supplier: LCSC; Diode Configuration: 独立式; Zener Voltage (Nom): 16V; Reverse Leakage Current (Ir): 100nA@11.2V; Zener Voltage (Range): 15.3V~17.1V; Power Dissipation: 500mW; Zener Impedance (Zzt): 40Ω
D24 D25 = SS54_C22452: 二极管配置:独立式;正向压降(Vf):550mV@5A;直流反向耐压(Vr):40V;整流电流:5A;; LCSC Part Name: 电压:40V 电流:5A; Supplier Part: C22452; Manufacturer: MDD(辰达半导体); Supplier Footprint: SMA(DO-214AC); JLCPCB Part Class: 基础库; Datasheet: https://atta.szlcsc.com/upload/public/pdf/source/20230314/529CD85F9B31F69841D3A079BC07E377.pdf; Supplier: LCSC; Diode Configuration: 独立式; Forward Voltage (Vf@If): 550mV@5A; Reverse Voltage (Vr): 40V; Rectified Current: 5A; Reverse Leakage Current (Ir): 1mA@40V
H3 = PZ254V-12-6P: 插针结构:2x3P;间距:2.54mm;行距:2.54mm;圆针/方针:方针;安装类型:直插;排数:双排;总PIN位数:6P;额定电流:-;额定电压:-;配合针长度:6mm;塑高:2.5mm;端接针长度:3mm;触头材质:黄铜;触头镀层:-;工作温度范围:-40℃~+105℃;颜色:黑色;; LCSC Part Name: 间距:2.54mm 2x3P 直插 方针; Supplier Part: C492420; Manufacturer: XFCN(兴飞); Supplier Footprint: 插件,P=2.54mm; JLCPCB Part Class: 扩展库; Datasheet: https://atta.szlcsc.com/upload/public/pdf/source/20200309/C492420_BAECB307B001054C09D200388220EAE6.pdf; Supplier: LCSC; Pin Structure: 2x3P; Pitch: 2.54mm; Row Spacing: 2.54mm; Circluar Pins/Square Pins: 方针; Mounting Type: 直插; Number of Rows: 双排; Number of Pins: 6P; Length of Mating Pin: 6mm; Insulation Height: 2.5mm; Length of End Connection Pin: 3mm; Contact Material: 黄铜; Operating Temperature Range: -40℃~+105℃; Color: 黑色
L4 L7 = FXL0630-4R7-M: 电感值:4.7uH;精度:±20%;额定电流:6A;饱和电流(Isat):9A;类型:一体成型电感;; LCSC Part Name: 4.7uH ±20% 9A; Supplier Part: C167220; Manufacturer: cjiang(长江微电); Supplier Footprint: SMD,6.6x7mm; JLCPCB Part Class: 扩展库; Datasheet: https://atta.szlcsc.com/upload/public/pdf/source/20240426/3189EA8206330E2108542F9E34E540E7.pdf; Supplier: LCSC; Tolerance: ±20%; Rated Current: 6A; Saturation Current (Isat): 9A; DC Resistance (DCR): 33mΩ; Type: 一体成型电感
Q11 = TPH1R403NL: Supplier: LCSC; Manufacturer: TOSHIBA; Supplier Part: C83440; JLCPCB Part Class: Extend; JLCPCB SMD: Yes
R138 = ST-4EA 100K ohm (104): 阻值:100kΩ;精度:±20%;; LCSC Part Name: 100kΩ ±20%; Supplier Part: C132880; Manufacturer: NIDEC(尼得科); Supplier Footprint: SMD; JLCPCB Part Class: 扩展库; Datasheet: https://atta.szlcsc.com/upload/public/pdf/source/20170930/C132883_1506736317962997236.pdf; Supplier: LCSC; Tolerance: ±20%
R177 R178 = 0603WAF1000T5E: 电阻类型:厚膜电阻;阻值:100Ω;精度:±1%;功率:100mW;最大工作电压:75V;温度系数:±200ppm/℃;; LCSC Part Name: 100Ω ±1% 100mW 厚膜电阻; Supplier Part: C22775; Manufacturer: UNI-ROYAL(厚声); Supplier Footprint: 0603; JLCPCB Part Class: 基础库; Datasheet: https://atta.szlcsc.com/upload/public/pdf/source/20200306/C422600_1E6D84923E4A46A82E41ADD87F860B5C.pdf; Supplier: LCSC; Type: 厚膜电阻; Tolerance: ±1%; Power(Watts): 100mW; Overload Voltage (Max): 75V; Temperature Coefficient: ±200ppm/℃; Operating Temperature Range: -55℃~+155℃
SW1 = SS-3235S-L3: 电路结构:双刀双掷;安装方式:立贴;开关颜色:黑色;额定电流(DC):50mA;额定电压(DC):12V;额定电流(AC):50mA;额定电压(AC):12V;机械寿命:1万次;; LCSC Part Name: 柄长4mm 立贴双档 滑动开关; Supplier Part: C381098; Manufacturer: XKB Connectivity(中国星坤); Supplier Footprint: SMD; JLCPCB Part Class: 扩展库; Datasheet: https://atta.szlcsc.com/upload/public/pdf/source/20200227/C381098_2A18B7660478ED4C962829E19BCD5514.pdf; Supplier: LCSC; Circuit: 双刀双掷; Actuator Style: 矩形柱状; Pin Style: SMD接片; Switch Length: 9.1mm; Switch Width: 3.55mm; Switch Height: 6.6mm; Mounting Style: 立贴; Actuator Color: 黑色; Current Rating (DC): 50mA; Voltage Rating (DC): 12V; Current Rating (AC): 50mA; Voltage Rating (AC): 12V; Mechanical Life: 1万次; Operating Temperature: -40℃~+85℃
U27 = SP1N28STER: Supplier Part: C9900119712; Supplier Footprint: ESOP8L; Supplier: LCSC
U59 = SCT2450STER: 功能类型:降压型;输入电压:3.8V~36V;输出电流:5A;; LCSC Part Name: 3.8V-36V输入,5A输出,高效率同步降压DC-DC转换器; Supplier Part: C509400; Manufacturer: SCT(芯洲科技); Supplier Footprint: ESOP-8; JLCPCB Part Class: 扩展库; Datasheet: https://atta.szlcsc.com/upload/public/pdf/source/20200407/C509400_EDF779A672A59398CFBA9E95FA584FEC.pdf; Supplier: LCSC; Function: 降压型; Input Voltage: 3.8V~36V; Output Current: 5A; Switching Frequency: 100kHz~1.1MHz; Operating Temperature: -40℃~+125℃@(TJ); Synchronous Rectification: 是; Number of Outputs: 1; Switch tube (built-in/external): 内置
J1 J3 J4 = M3螺帽
R13 = 0603WAF2003T5E: 电阻类型:厚膜电阻;阻值:200kΩ;精度:±1%;功率:100mW;最大工作电压:75V;温度系数:±100ppm/℃;; LCSC Part Name: 200kΩ ±1% 100mW 厚膜电阻; Supplier Part: C25811; Manufacturer: UNI-ROYAL(厚声); Supplier Footprint: 0603; JLCPCB Part Class: 基础库; Datasheet: https://atta.szlcsc.com/upload/public/pdf/source/20200306/C422600_1E6D84923E4A46A82E41ADD87F860B5C.pdf; Supplier: LCSC; Type: 厚膜电阻; Tolerance: ±1%; Power(Watts): 100mW; Overload Voltage (Max): 75V; Temperature Coefficient: ±100ppm/℃; Operating Temperature Range: -55℃~+155℃
R14 = 0603WAF2002T5E: 电阻类型:厚膜电阻;阻值:20kΩ;精度:±1%;功率:100mW;最大工作电压:75V;温度系数:±100ppm/℃;; LCSC Part Name: 20kΩ ±1% 100mW 厚膜电阻; Supplier Part: C4184; Manufacturer: UNI-ROYAL(厚声); Supplier Footprint: 0603; JLCPCB Part Class: 基础库; Datasheet: https://atta.szlcsc.com/upload/public/pdf/source/20200306/C422600_1E6D84923E4A46A82E41ADD87F860B5C.pdf; Supplier: LCSC; Type: 厚膜电阻; Tolerance: ±1%; Power(Watts): 100mW; Overload Voltage (Max): 75V; Temperature Coefficient: ±100ppm/℃; Operating Temperature Range: -55℃~+155℃
U58 母版连接 = PZ254-2-06-WS: 插针结构:2x6P;间距:2.54mm;行距:2.54mm;圆针/方针:方针;安装类型:卧贴;排数:双排;总PIN位数:12P;额定电流:3A;额定电压:-;配合针长度:6mm;塑高:2.5mm;端接针长度:-;工作温度范围:-40℃~+105℃;焊接温度(最大值):260℃@10S;颜色:黑色;; LCSC Part Name: 2x6P 间距:2.54mm 方针 卧贴 黑色; Supplier Part: C5149356; Manufacturer: HCTL(华灿天禄); Supplier Footprint: SMD,P=2.54mm,卧贴; JLCPCB Part Class: 扩展库; Datasheet: https://atta.szlcsc.com/upload/public/pdf/source/20230609/395CF6299CB3DEE695290492722C7F5B.pdf; Supplier: LCSC; Pin Structure: 2x6P; Pitch: 2.54mm; Row Spacing: 2.54mm; Circluar Pins/Square Pins: 方针; Mounting Type: 卧贴; Number of Rows: 双排; Number of Pins: 12P; Current Rating (Max): 3A; Length of Mating Pin: 6mm; Insulation Height: 2.5mm; Operating Temperature Range: -40℃~+105℃; Soldering Temperature(Max): 260℃@10S; Color: 黑色
编码器1 = PZ254-2-03-S: 插针结构:2x3P;间距:2.54mm;行距:2.54mm;圆针/方针:方针;安装类型:立贴;排数:双排;总PIN位数:6P;额定电流:3A;额定电压:250V;配合针长度:6mm;塑高:2.5mm;端接针长度:-;工作温度范围:-40℃~+105℃;焊接温度(最大值):260℃@5S;颜色:黑色;; LCSC Part Name: 2x3P 间距:2.54mm 方针 立贴 黑色; Supplier Part: C3294461; Manufacturer: HCTL(华灿天禄); Supplier Footprint: SMD,P=2.54mm; JLCPCB Part Class: 扩展库; Datasheet: https://atta.szlcsc.com/upload/public/pdf/source/20230609/FB2B5B924AA338E6CB93C3BD1D012B72.pdf; Supplier: LCSC; Pin Structure: 2x3P; Pitch: 2.54mm; Row Spacing: 2.54mm; Circluar Pins/Square Pins: 方针; Mounting Type: 立贴; Number of Rows: 双排; Number of Pins: 6P; Current Rating (Max): 3A; Voltage Rating (Max): 250V; Length of Mating Pin: 6mm; Insulation Height: 2.5mm; Operating Temperature Range: -40℃~+105℃; Soldering Temperature(Max): 260℃@5S; Color: 黑色

## Nets
+3V3: C45.2 R68.2 SW4.2 U10.2(VOUT)
+12V_IN: CN15.1(+) D2.1(K) Q11.1(S) Q11.2(S) Q11.3(S) SW1.3
AVDD_1: C126.2 R165.1 U39.6(VREF) U39.7(AVDD)
DVDD_1: C127.2 C132.2 R161.1 R162.1 U11.14(VCC) U39.8(DVDD)
GND_BAT: C12.1 C78.2 C79.1 C80.1 C82.1 C83.2 C84.2 CN6.1(-) LED6.1(K) R10.1 R14.2 R126.1 R129.1 R180.1 U27.7(GND) U27.9(EP) 母版连接.11
GND_MOTO: C44.1 C45.1 C86.1 C90.2 C94.1 C95.1 C96.1 C120.1 C126.1 C127.1 C132.1 C133.1 C134.1 C135.1 C136.1 C142.1 C145.2 C146.2 C147.1 C148.1 CN13.2 CN14.2 CN15.2(-) CN16.2 H3.5 H3.6 LED4.1(K) LED5.1(K) LED7.1(K) R132.1 R135.1 R168.1 R173.1 R174.1 R175.1 R176.1 R180.2 U10.1(VSS) U11.1(1OE#) U11.4(2OE#) U11.7(GND) U11.10(3OE#) U11.13(4OE#) U37.2 U39.5(GND) U39.16(GND) U39.20(SN) U39.25(EP) U41.3(IN-) U56.2 U59.7(GND) U59.9(EP)
GND_PRO: U41.1(NC) U41.7(REF1) 母版连接.4 母版连接.10 编码器1.1
VCC_3V3: 母版连接.3 母版连接.9 编码器1.2
VCC_+5V: CN6.2(+) D25.2(K) R127.2 R130.2
VCC_BAT: C44.2 C86.2 C94.2 C95.2 C96.2 C133.2 C134.2 C135.2 C136.2 C142.2 C145.1 C147.2 CN13.1 CN14.1 CN16.1 D24.1(A) D28.2(A) Q11.5(D) Q21.5(D) Q21.6(D) Q21.7(D) Q21.8(D) Q21.9(D) Q23.5(D) Q23.6(D) Q23.7(D) Q23.8(D) Q23.9(D) R13.1 U10.3(VIN) U56.1 U59.2(VIN) U59.3(EN)
VCC_SERVO: C146.1 C148.2 H3.3 H3.4 L7.2 R133.2 R136.2
BAT_ADC: C12.2 R13.2 R14.1 母版连接.12
EN-IN_1: R90.1 R173.2 U11.5(2A)
EN_1: U11.6(2Y) U39.14(EN)
ENCODER_DIR_1: 母版连接.6 编码器1.4
ENCODER_STL_1: 母版连接.5 编码器1.3
ENIN_1: R90.2 母版连接.2
GH1_1: Q23.4(G) U39.17(GH1)
GH2_1: Q21.4(G) U39.24(GH2)
GL1_1: Q24.4(G) U39.19(GL1)
GL2_1: Q22.4(G) U39.22(GL2)
I_OUT_1: U41.8(OUT) 母版连接.8
NSLEEP: R69.2 SW4.3 U39.13(nSLEEP)
PH-IN_1: R89.1 R174.2 U11.2(1A)
PH_1: U11.3(1Y) U39.15(PH)
PHIN_1: R89.2 母版连接.1
SERVO_1: R177.1
SERVO_2: R178.2
SH1_1: Q23.1(S) Q23.2(S) Q23.3(S) Q24.5(D) Q24.6(D) Q24.7(D) Q24.8(D) Q24.9(D) U39.18(SH1) U60.2
SH2_1: Q21.1(S) Q21.2(S) Q21.3(S) Q22.5(D) Q22.6(D) Q22.7(D) Q22.8(D) Q22.9(D) U39.23(SH2) U60.1
SP_1: Q22.1(S) Q22.2(S) Q22.3(S) Q24.1(S) Q24.2(S) Q24.3(S) U37.1 U39.21(SP) U41.2(IN+)
$2N2538: R161.2 U39.9(nFAULT)
$2N2539: R162.2 U39.10(SNSOUT)
$2N2543: C120.2 C121.1 D28.1(K) U39.1(VM)
$2N2544: C121.2 U39.2(VCP)
$2N2545: C122.1 U39.3(CPH)
$2N2549: R165.2 R168.2 U39.12(IDRIVE)
$2N2590: C122.2 U39.4(CPL)
$2N2594: LED4.2(A) R68.1
$2N2595: LED5.2(A) R69.1
$2N2609: R176.2 U11.12(4A)
$2N2610: R175.2 U11.9(3A)
$2N2632: C130.1 U41.5(VS) U41.6(REF2)
$2N2649: C130.2 U41.4(GND)
$3N3799: C83.1 R131.2
$3N3800: R131.1 U27.6(COMP)
$3N3801: C81.1 U27.1(BOOT)
$3N3802: C82.2 C84.1 D25.1(A) L4.2
$3N3804: R128.1 R129.2 U27.5(FB)
$3N3805: C81.2 L4.1 U27.8(SW)
$3N3806: LED6.2(A) R130.1
$3N3807: R127.1 R128.2
$3N3808: C78.1 C79.2 C80.2 D24.2(K) U27.2(VIN) U27.3(EN)
$3N3809: R126.2 U27.4(RT/CLK)
$3N4862: Q11.4(G) SW1.2
$3N4863: D2.2(A) R10.2 SW1.1
Net-(C88-1): C88.1 U59.1(BOOT)
Net-(C88-2): C88.2 L7.1 U59.8(SW)
Net-(C90-1): C90.1 R137.2
Net-(H3-1): H3.1 R177.2
Net-(H3-2): H3.2 R178.1
Net-(LED7-2): LED7.2(A) R136.1
Net-(R132-2): R132.2 U59.4(RT/CLK)
Net-(R133-1): R133.1 R138.2 R138.3
Net-(R135-2): R135.2 R138.1 U59.5(FB)
Net-(R137-1): R137.1 U59.6(COMP)

Not connected (* = marked no-connect by the designer): CN6 3 4; J1 1; J3 1; J4 1; SW1 4 5 6; SW4 1* 4; U11 8(3Y)* 11(4Y)*; U39 11(SO)*; U56 3 4; U58 1* 2* 3* 4* 5* 6* 7* 8* 9* 10* 11* 12*; 母版连接 7; 编码器1 5* 6*

## Notes on the sheets
sheet 2
- 输入电源
- 保护电路
- H桥驱动1
- 驱动单片机接口
- 指示灯开关
- H桥1
sheet 3
- 舵机接口
- 舵机电源
- 开关防打火电路
- 开关电路
- 12v转5v
